# Altium schematic sheet Sheet1.SchDoc
size A2; SheetNumber: 1; SheetTotal: 1
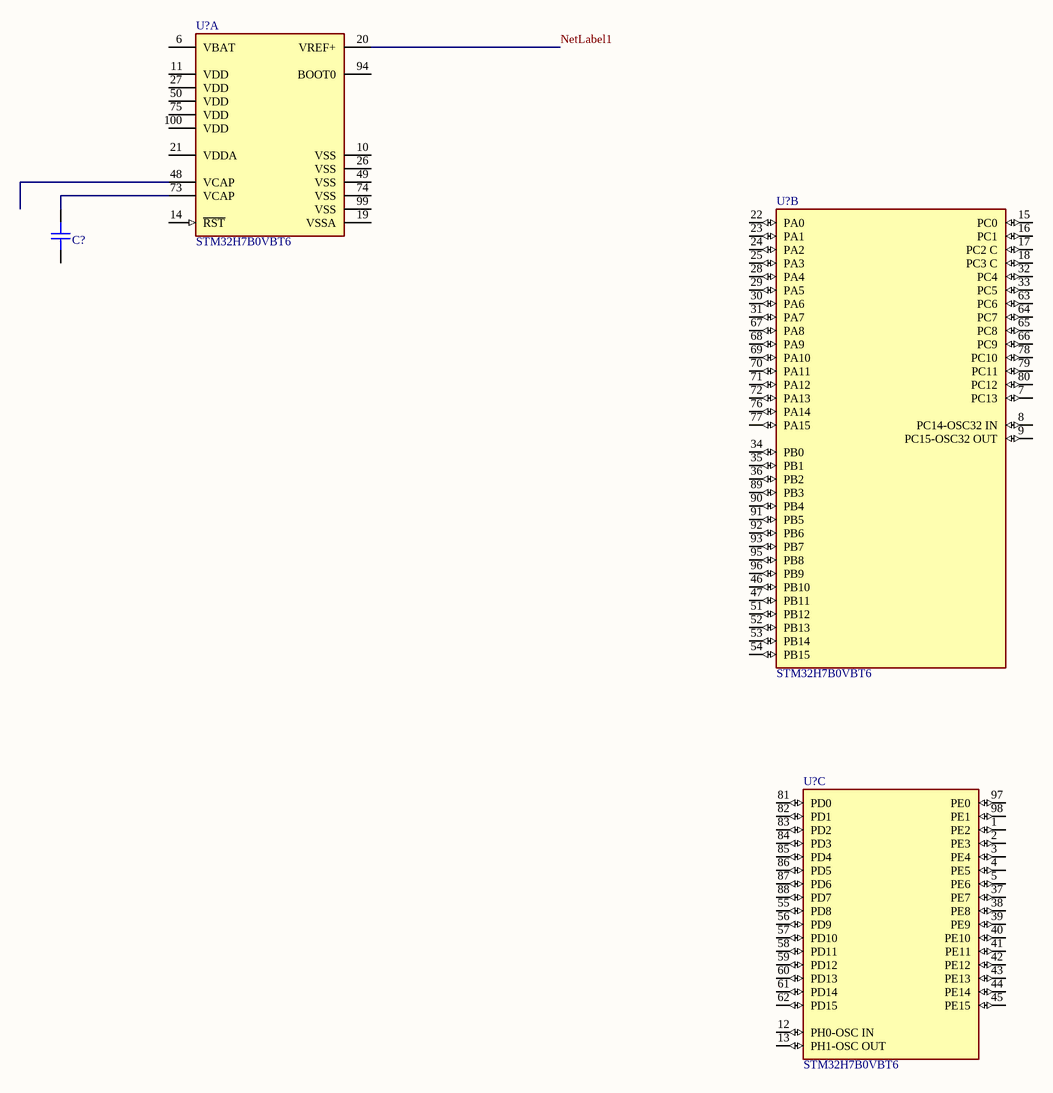
[diagram p0: Sheet1.SchDoc]

## Parts
(Parts that share a designator on the sheet are numbered #1, #2 ... from top to bottom, then left to right.)
C?  CAP_0402_25V  [CAP_0402]  (value not drawn)
U?#1  STM32H7B0VBT6  [FP-LQFP100-MFG]  (part A of 3)
U?#2  STM32H7B0VBT6  [FP-LQFP100-MFG]  (part B of 3)
U?#3  STM32H7B0VBT6  [FP-LQFP100-MFG]  (part C of 3)

## Nets
NetLabel1: U?#1.20(VREF+)
NetC?_2: C?.2 U?#1.73(VCAP)

Not connected (* = marked no-connect by the designer): C? 1; U?#1 6(VBAT) 10(VSS) 11(VDD) 14(~{RST}) 19(VSSA) 21(VDDA) 26(VSS) 27(VDD) 48(VCAP) 49(VSS) 50(VDD) 74(VSS) 75(VDD) 94(BOOT0) 99(VSS) 100(VDD); U?#2 7(PC13) 8(PC14-OSC32_IN) 9(PC15-OSC32_OUT) 15(PC0) 16(PC1) 17(PC2_C) 18(PC3_C) 22(PA0) 23(PA1) 24(PA2) 25(PA3) 28(PA4) 29(PA5) 30(PA6) 31(PA7) 32(PC4) 33(PC5) 34(PB0) 35(PB1) 36(PB2) 46(PB10) 47(PB11) 51(PB12) 52(PB13) 53(PB14) 54(PB15) 63(PC6) 64(PC7) 65(PC8) 66(PC9) 67(PA8) 68(PA9) 69(PA10) 70(PA11) 71(PA12) 72(PA13) 76(PA14) 77(PA15) 78(PC10) 79(PC11) 80(PC12) 89(PB3) 90(PB4) 91(PB5) 92(PB6) 93(PB7) 95(PB8) 96(PB9); U?#3 1(PE2) 2(PE3) 3(PE4) 4(PE5) 5(PE6) 12(PH0-OSC_IN) 13(PH1-OSC_OUT) 37(PE7) 38(PE8) 39(PE9) 40(PE10) 41(PE11) 42(PE12) 43(PE13) 44(PE14) 45(PE15) 55(PD8) 56(PD9) 57(PD10) 58(PD11) 59(PD12) 60(PD13) 61(PD14) 62(PD15) 81(PD0) 82(PD1) 83(PD2) 84(PD3) 85(PD4) 86(PD5) 87(PD6) 88(PD7) 97(PE0) 98(PE1)

## Library data of the parts
C? = CMP-005-000005-1: Capacitor SMD 0402 25V; Design Item ID: CAP_0402_25V; Source: Schematic-Lib-PhilsLab.SchLib
U?#1-U?#3 = CMP-12105-000109-1: IC MCU 32BIT 128KB FLASH 100LQFP